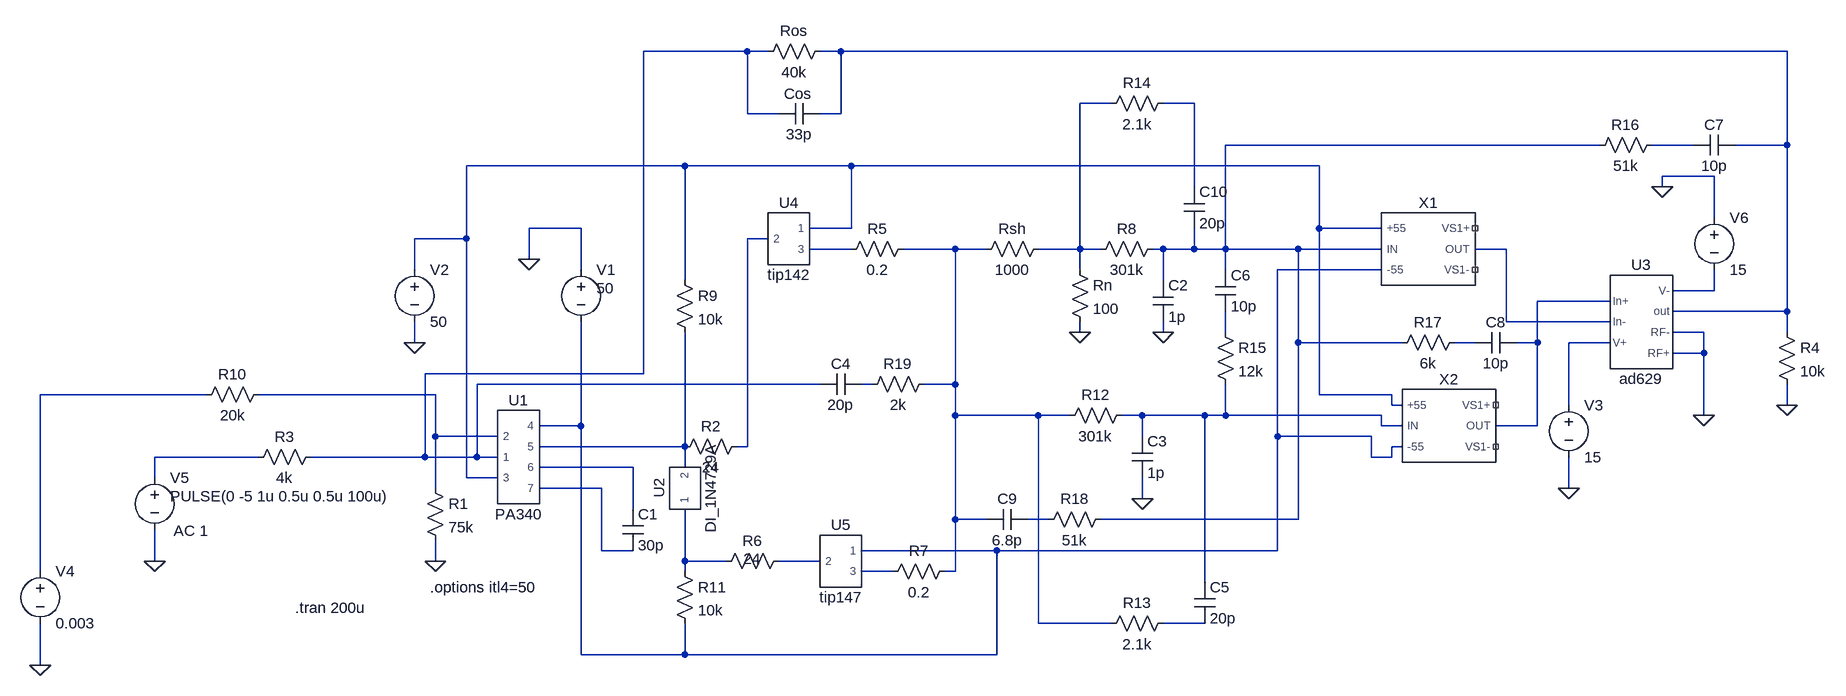
[diagram p0: schematic Draft19.asc]
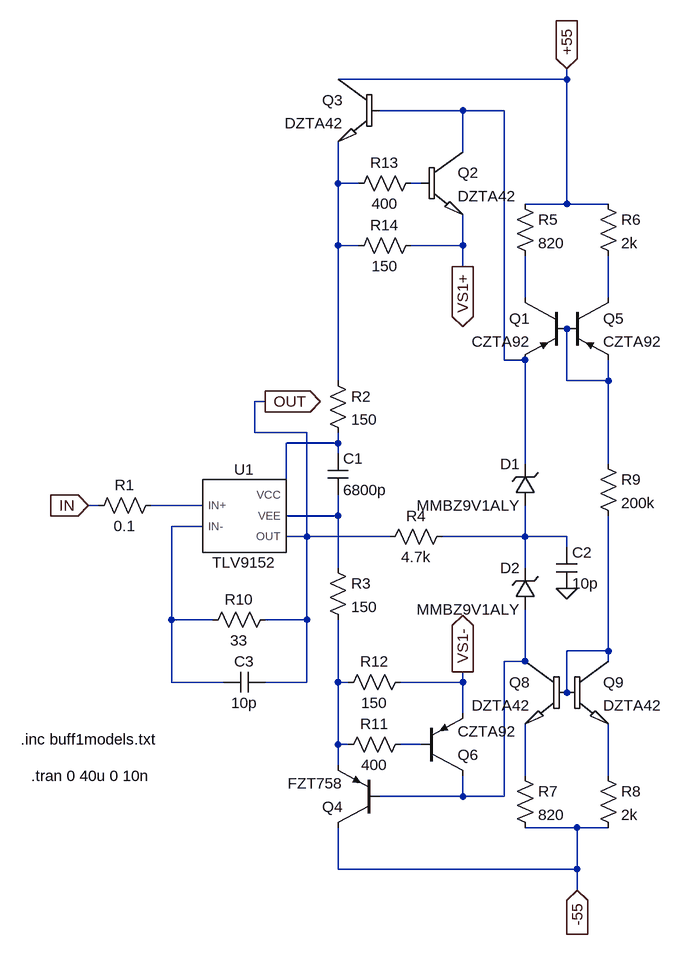
[diagram p1: sub-circuit draft1.asc]
Draft19.asc, the LTspice schematic file:
Version 4
SHEET 1 2340 884
WIRE 544 -464 384 -464
WIRE 576 -464 544 -464
WIRE 688 -464 656 -464
WIRE 2144 -464 688 -464
WIRE 1104 -384 1056 -384
WIRE 1232 -384 1184 -384
WIRE 544 -368 544 -464
WIRE 592 -368 544 -368
WIRE 688 -368 688 -464
WIRE 688 -368 656 -368
WIRE 1856 -320 1280 -320
WIRE 2000 -320 1936 -320
WIRE 2144 -320 2144 -464
WIRE 2144 -320 2064 -320
WIRE 448 -288 112 -288
WIRE 704 -288 448 -288
WIRE 1424 -288 704 -288
WIRE 2032 -272 1952 -272
WIRE 1232 -256 1232 -384
WIRE 1952 -256 1952 -272
WIRE 2032 -208 2032 -272
WIRE 288 -192 208 -192
WIRE 704 -192 704 -288
WIRE 704 -192 640 -192
WIRE 1424 -192 1424 -288
WIRE 1520 -192 1424 -192
WIRE 112 -176 112 -288
WIRE 112 -176 32 -176
WIRE 576 -176 544 -176
WIRE 704 -160 640 -160
WIRE 864 -160 784 -160
WIRE 912 -160 864 -160
WIRE 1056 -160 1056 -384
WIRE 1056 -160 992 -160
WIRE 1088 -160 1056 -160
WIRE 1184 -160 1168 -160
WIRE 1232 -160 1232 -192
WIRE 1232 -160 1184 -160
WIRE 1280 -160 1280 -320
WIRE 1280 -160 1232 -160
WIRE 1392 -160 1280 -160
WIRE 1520 -160 1392 -160
WIRE 1712 -160 1664 -160
WIRE 208 -144 208 -192
WIRE 32 -128 32 -176
WIRE 288 -128 288 -192
WIRE 1056 -128 1056 -160
WIRE 1280 -128 1280 -160
WIRE 1520 -128 1360 -128
WIRE 448 -112 448 -288
WIRE 1184 -112 1184 -160
WIRE 2032 -96 2032 -128
WIRE 2032 -96 1968 -96
WIRE 1872 -80 1760 -80
WIRE 2144 -64 2144 -320
WIRE 2144 -64 1968 -64
WIRE 1712 -48 1712 -160
WIRE 1872 -48 1712 -48
WIRE 1056 -32 1056 -48
WIRE 1184 -32 1184 -48
WIRE 1280 -32 1280 -64
WIRE 2016 -32 1968 -32
WIRE 2144 -32 2144 -64
WIRE 32 -16 32 -48
WIRE 1392 -16 1392 -160
WIRE 1552 -16 1392 -16
WIRE 1664 -16 1632 -16
WIRE 1760 -16 1760 -80
WIRE 1760 -16 1728 -16
WIRE 1872 -16 1808 -16
WIRE 2016 0 2016 -32
WIRE 2016 0 1968 0
WIRE 384 32 384 -464
WIRE 384 32 48 32
WIRE 656 48 128 48
WIRE 736 48 720 48
WIRE 864 48 864 -160
WIRE 864 48 816 48
WIRE -288 64 -544 64
WIRE 64 64 -208 64
WIRE 1424 64 1424 -192
WIRE 1536 64 1424 64
WIRE 1536 80 1536 64
WIRE 1552 80 1536 80
WIRE 1808 80 1808 -16
WIRE 2144 80 2144 48
WIRE 864 96 864 48
WIRE 992 96 864 96
WIRE 1040 96 992 96
WIRE 1152 96 1120 96
WIRE 1248 96 1152 96
WIRE 1280 96 1280 48
WIRE 1280 96 1248 96
WIRE 1520 96 1280 96
WIRE 2016 96 2016 0
WIRE 288 112 288 -48
WIRE 288 112 224 112
WIRE 1520 112 1520 96
WIRE 1552 112 1520 112
WIRE 1760 112 1760 -16
WIRE 1760 112 1696 112
WIRE 64 128 64 64
WIRE 160 128 64 128
WIRE 1152 128 1152 96
WIRE 1360 128 1360 -128
WIRE 1504 128 1360 128
WIRE 448 144 448 -32
WIRE 448 144 224 144
WIRE 544 144 544 -176
WIRE 544 144 528 144
WIRE 1552 144 1536 144
WIRE -208 160 -368 160
WIRE 48 160 48 32
WIRE 48 160 -128 160
WIRE 128 160 128 48
WIRE 128 160 48 160
WIRE 160 160 128 160
WIRE 1504 160 1504 128
WIRE 1536 160 1536 144
WIRE 1536 160 1504 160
WIRE 368 176 224 176
WIRE 448 176 448 144
WIRE -368 192 -368 160
WIRE 112 192 112 -176
WIRE 160 192 112 192
WIRE 64 208 64 128
WIRE 320 208 224 208
WIRE 1808 208 1808 160
WIRE 1152 224 1152 192
WIRE 368 240 368 176
WIRE 864 256 864 96
WIRE 912 256 864 256
WIRE 1008 256 976 256
WIRE 1392 256 1392 -16
WIRE 1392 256 1088 256
WIRE 320 304 320 208
WIRE 368 304 320 304
WIRE 928 304 720 304
WIRE 1360 304 1360 128
WIRE 1360 304 928 304
WIRE -368 320 -368 272
WIRE 64 320 64 288
WIRE 448 320 448 240
WIRE 512 320 448 320
WIRE 656 320 592 320
WIRE -544 336 -544 64
WIRE 448 336 448 320
WIRE 768 336 720 336
WIRE 864 336 864 256
WIRE 864 336 848 336
WIRE 1248 352 1248 96
WIRE 992 416 992 96
WIRE 1104 416 992 416
WIRE 1248 416 1184 416
WIRE 288 464 288 112
WIRE 448 464 448 416
WIRE 448 464 288 464
WIRE 928 464 928 304
WIRE 928 464 448 464
WIRE -544 480 -544 416
FLAG 32 -16 0
FLAG 208 -144 0
FLAG -544 480 0
FLAG 1056 -32 0
FLAG -368 320 0
FLAG 64 320 0
FLAG 1808 208 0
FLAG 2016 96 0
FLAG 1952 -256 0
FLAG 2144 80 0
FLAG 1184 -32 0
FLAG 1152 224 0
SYMBOL PA340 192 160 R0
SYMATTR InstName U1
SYMBOL res 48 192 R0
SYMATTR InstName R1
SYMATTR Value 75k
SYMBOL res 544 128 R90
WINDOW 0 0 56 VBottom 2
WINDOW 3 32 56 VTop 2
SYMATTR InstName R2
SYMATTR Value 24
SYMBOL res -112 144 R90
WINDOW 0 0 56 VBottom 2
WINDOW 3 32 56 VTop 2
SYMATTR InstName R3
SYMATTR Value 4k
SYMBOL cap 352 240 R0
SYMATTR InstName C1
SYMATTR Value 30p
SYMBOL voltage 288 -144 R0
WINDOW 3 24 44 Left 2
WINDOW 123 0 0 Left 0
WINDOW 39 0 0 Left 0
SYMATTR Value 50
SYMATTR InstName V1
SYMBOL voltage 32 -144 R0
WINDOW 123 0 0 Left 0
WINDOW 39 0 0 Left 0
SYMATTR InstName V2
SYMATTR Value 50
SYMBOL res 1040 -144 R0
SYMATTR InstName Rn
SYMATTR Value 100
SYMBOL res 672 -480 R90
WINDOW 0 0 56 VBottom 2
WINDOW 3 32 56 VTop 2
SYMATTR InstName Ros
SYMATTR Value 40k
SYMBOL cap 656 -384 R90
WINDOW 0 1 34 VBottom 2
WINDOW 3 32 32 VTop 2
SYMATTR InstName Cos
SYMATTR Value 33p
SYMBOL res -192 48 R90
WINDOW 0 0 56 VBottom 2
WINDOW 3 32 56 VTop 2
SYMATTR InstName R10
SYMATTR Value 20k
SYMBOL voltage -368 176 R0
WINDOW 123 29 97 Left 2
WINDOW 39 0 0 Left 0
WINDOW 3 24 44 Left 2
SYMATTR Value2 AC 1
SYMATTR Value PULSE(0 -5 1u 0.5u 0.5u 100u)
SYMATTR InstName V5
SYMBOL res 608 304 R90
WINDOW 0 0 56 VBottom 2
WINDOW 3 28 56 VBottom 2
SYMATTR InstName R6
SYMATTR Value 24
SYMBOL voltage -544 320 R0
WINDOW 123 0 0 Left 0
WINDOW 39 0 0 Left 0
SYMATTR InstName V4
SYMATTR Value 0.003
SYMBOL tip142 608 -176 R0
SYMATTR InstName U4
SYMBOL tip147 688 320 R0
SYMATTR InstName U5
SYMBOL res 800 -176 R90
WINDOW 0 0 56 VBottom 2
WINDOW 3 32 56 VTop 2
SYMATTR InstName R5
SYMATTR Value 0.2
SYMBOL res 864 320 R90
WINDOW 0 0 56 VBottom 2
WINDOW 3 32 56 VTop 2
SYMATTR InstName R7
SYMATTR Value 0.2
SYMBOL res 432 -128 R0
SYMATTR InstName R9
SYMATTR Value 10k
SYMBOL res 432 320 R0
SYMATTR InstName R11
SYMATTR Value 10k
SYMBOL DI_1N4729A 448 208 R270
SYMATTR InstName U2
SYMBOL res 1008 -176 R90
WINDOW 0 0 56 VBottom 2
WINDOW 3 32 56 VTop 2
SYMATTR InstName Rsh
SYMATTR Value 1000
SYMBOL ad629 1920 -48 R0
SYMATTR InstName U3
SYMBOL voltage 1808 64 R0
WINDOW 123 0 0 Left 0
WINDOW 39 0 0 Left 0
SYMATTR InstName V3
SYMATTR Value 15
SYMBOL voltage 2032 -224 R0
WINDOW 123 0 0 Left 0
WINDOW 39 0 0 Left 0
SYMATTR InstName V6
SYMATTR Value 15
SYMBOL res 2128 -48 R0
SYMATTR InstName R4
SYMATTR Value 10k
SYMBOL res 1184 -176 R90
WINDOW 0 0 56 VBottom 2
WINDOW 3 32 56 VTop 2
SYMATTR InstName R8
SYMATTR Value 301k
SYMBOL res 1136 80 R90
WINDOW 0 0 56 VBottom 2
WINDOW 3 32 56 VTop 2
SYMATTR InstName R12
SYMATTR Value 301k
SYMBOL cap 1168 -112 R0
SYMATTR InstName C2
SYMATTR Value 1p
SYMBOL cap 1136 128 R0
SYMATTR InstName C3
SYMATTR Value 1p
SYMBOL cap 1264 -128 R0
SYMATTR InstName C6
SYMATTR Value 10p
SYMBOL res 1264 -48 R0
SYMATTR InstName R15
SYMATTR Value 12k
SYMBOL cap 2064 -336 R90
WINDOW 0 0 32 VBottom 2
WINDOW 3 32 32 VTop 2
SYMATTR InstName C7
SYMATTR Value 10p
SYMBOL res 1952 -336 R90
WINDOW 0 0 56 VBottom 2
WINDOW 3 32 56 VTop 2
SYMATTR InstName R16
SYMATTR Value 51k
SYMBOL cap 1728 -32 R90
WINDOW 0 0 32 VBottom 2
WINDOW 3 32 32 VTop 2
SYMATTR InstName C8
SYMATTR Value 10p
SYMBOL res 1648 -32 R90
WINDOW 0 0 56 VBottom 2
WINDOW 3 32 56 VTop 2
SYMATTR InstName R17
SYMATTR Value 6k
SYMBOL cap 976 240 R90
WINDOW 0 0 32 VBottom 2
WINDOW 3 32 32 VTop 2
SYMATTR InstName C9
SYMATTR Value 6.8p
SYMBOL res 1104 240 R90
WINDOW 0 0 56 VBottom 2
WINDOW 3 32 56 VTop 2
SYMATTR InstName R18
SYMATTR Value 51k
SYMBOL Draft1 1584 -160 R0
SYMATTR InstName X1
SYMBOL Draft1 1616 112 R0
SYMATTR InstName X2
SYMBOL cap 1232 352 R0
SYMATTR InstName C5
SYMATTR Value 20p
SYMBOL res 1200 400 R90
WINDOW 0 0 56 VBottom 2
WINDOW 3 32 56 VTop 2
SYMATTR InstName R13
SYMATTR Value 2.1k
SYMBOL cap 1216 -256 R0
SYMATTR InstName C10
SYMATTR Value 20p
SYMBOL res 1200 -400 R90
WINDOW 0 0 56 VBottom 2
WINDOW 3 32 56 VTop 2
SYMATTR InstName R14
SYMATTR Value 2.1k
SYMBOL cap 720 32 R90
WINDOW 0 0 32 VBottom 2
WINDOW 3 32 32 VTop 2
SYMATTR InstName C4
SYMATTR Value 20p
SYMBOL res 832 32 R90
WINDOW 0 0 56 VBottom 2
WINDOW 3 32 56 VTop 2
SYMATTR InstName R19
SYMATTR Value 2k
TEXT 56 360 Left 2 !.options itl4=50
TEXT -152 392 Left 2 !.tran 200u

draft1.asc, the sub-circuit schematic file:
Version 4
SHEET 1 1440 892
WIRE 688 -496 688 -512
WIRE 688 -496 336 -496
WIRE 528 -448 400 -448
WIRE 592 -448 528 -448
WIRE 528 -384 528 -448
WIRE 336 -336 336 -400
WIRE 368 -336 336 -336
WIRE 464 -336 448 -336
WIRE 688 -304 688 -496
WIRE 688 -304 624 -304
WIRE 752 -304 688 -304
WIRE 336 -240 336 -336
WIRE 368 -240 336 -240
WIRE 528 -240 528 -288
WIRE 528 -240 448 -240
WIRE 528 -208 528 -240
WIRE 624 -160 624 -224
WIRE 752 -160 752 -224
WIRE 592 -64 592 -448
WIRE 624 -64 592 -64
WIRE 336 -32 336 -240
WIRE 688 -32 688 -112
WIRE 752 -32 752 -64
WIRE 752 -32 688 -32
WIRE 224 0 208 0
WIRE 208 48 208 0
WIRE 288 48 208 48
WIRE 336 64 336 48
WIRE 336 64 256 64
WIRE 336 80 336 64
WIRE 624 96 624 -64
WIRE 752 96 752 -32
WIRE 256 144 256 64
WIRE -32 160 -48 160
WIRE 128 160 48 160
WIRE 336 176 336 144
WIRE 336 176 256 176
WIRE 128 192 80 192
WIRE 288 208 288 48
WIRE 288 208 256 208
WIRE 416 208 288 208
WIRE 624 208 624 160
WIRE 624 208 496 208
WIRE 688 208 624 208
WIRE 688 224 688 208
WIRE 336 256 336 176
WIRE 624 256 624 208
WIRE 80 336 80 192
WIRE 144 336 80 336
WIRE 288 336 288 208
WIRE 288 336 224 336
WIRE 752 384 752 176
WIRE 752 384 688 384
WIRE 624 400 624 320
WIRE 624 400 592 400
WIRE 752 400 752 384
WIRE 80 432 80 336
WIRE 160 432 80 432
WIRE 288 432 288 336
WIRE 288 432 224 432
WIRE 336 432 336 336
WIRE 352 432 336 432
WIRE 528 432 528 416
WIRE 528 432 432 432
WIRE 688 448 688 384
WIRE 528 480 528 432
WIRE 336 528 336 432
WIRE 352 528 336 528
WIRE 464 528 432 528
WIRE 336 560 336 528
WIRE 624 576 624 496
WIRE 752 576 752 496
WIRE 528 608 528 576
WIRE 528 608 400 608
WIRE 592 608 592 400
WIRE 592 608 528 608
WIRE 704 656 624 656
WIRE 752 656 704 656
WIRE 336 720 336 656
WIRE 704 720 704 656
WIRE 704 720 336 720
WIRE 704 752 704 720
FLAG 688 288 0
FLAG -48 160 IN
IOPIN -48 160 In
FLAG 224 0 OUT
IOPIN 224 0 Out
FLAG 688 -512 +55
IOPIN 688 -512 In
FLAG 704 752 -55
IOPIN 704 752 In
FLAG 528 416 VS1-
IOPIN 528 416 Out
FLAG 528 -208 VS1+
IOPIN 528 -208 Out
SYMBOL TLV9152 192 176 R0
SYMATTR InstName U1
SYMBOL res 320 -48 R0
SYMATTR InstName R2
SYMATTR Value 150
SYMBOL res 320 240 R0
SYMATTR InstName R3
SYMATTR Value 150
SYMBOL res 512 192 R90
WINDOW 0 0 56 VBottom 2
WINDOW 3 32 56 VTop 2
SYMATTR InstName R4
SYMATTR Value 4.7k
SYMBOL res 608 -320 R0
SYMATTR InstName R5
SYMATTR Value 820
SYMBOL res 736 -320 R0
SYMATTR InstName R6
SYMATTR Value 2k
SYMBOL res 608 560 R0
SYMATTR InstName R7
SYMATTR Value 820
SYMBOL res 736 560 R0
SYMATTR InstName R8
SYMATTR Value 2k
SYMBOL res 736 80 R0
SYMATTR InstName R9
SYMATTR Value 200k
SYMBOL res 240 320 R90
WINDOW 0 0 56 VBottom 2
WINDOW 3 32 56 VTop 2
SYMATTR InstName R10
SYMATTR Value 33
SYMBOL cap 320 80 R0
SYMATTR InstName C1
SYMATTR Value 6800p
SYMBOL zener 640 160 R180
WINDOW 0 24 64 Left 2
WINDOW 3 24 0 Left 2
SYMATTR InstName D1
SYMATTR Value MMBZ9V1ALY
SYMBOL zener 640 320 R180
WINDOW 0 24 64 Left 2
WINDOW 3 24 0 Left 2
SYMATTR InstName D2
SYMATTR Value MMBZ9V1ALY
SYMBOL cap 672 224 R0
SYMATTR InstName C2
SYMATTR Value 10p
SYMBOL pnp 688 -160 M0
SYMATTR InstName Q1
SYMATTR Value CZTA92
SYMBOL pnp 688 -160 R0
SYMATTR InstName Q5
SYMATTR Value CZTA92
SYMBOL pnp 400 656 R180
SYMATTR InstName Q4
SYMATTR Value FZT758
SYMBOL res 64 144 R90
WINDOW 0 0 56 VBottom 2
WINDOW 3 32 56 VTop 2
SYMATTR InstName R1
SYMATTR Value 0.1
SYMBOL pnp 464 576 M180
SYMATTR InstName Q6
SYMATTR Value CZTA92
SYMBOL res 448 512 R90
WINDOW 0 0 56 VBottom 2
WINDOW 3 32 56 VTop 2
SYMATTR InstName R11
SYMATTR Value 400
SYMBOL res 448 416 R90
WINDOW 0 0 56 VBottom 2
WINDOW 3 32 56 VTop 2
SYMATTR InstName R12
SYMATTR Value 150
SYMBOL res 464 -352 R90
WINDOW 0 0 56 VBottom 2
WINDOW 3 32 56 VTop 2
SYMATTR InstName R13
SYMATTR Value 400
SYMBOL res 464 -256 R90
WINDOW 0 0 56 VBottom 2
WINDOW 3 32 56 VTop 2
SYMATTR InstName R14
SYMATTR Value 150
SYMBOL DZTA42 464 -384 R0
SYMATTR InstName Q2
SYMBOL DZTA42 400 -496 M0
SYMATTR InstName Q3
SYMBOL DZTA42 688 400 M0
SYMATTR InstName Q8
SYMBOL DZTA42 688 400 R0
SYMATTR InstName Q9
SYMBOL cap 224 416 R90
WINDOW 0 0 32 VBottom 2
WINDOW 3 32 32 VTop 2
SYMATTR InstName C3
SYMATTR Value 10p
TEXT -152 520 Left 2 !.inc buff1models.txt
TEXT -136 576 Left 2 !.tran 0 40u 0 10n

The netlist it stands for:
* Draft19.asc
XU1 N020 N001 N007 N012 N022 N024 N025 PA340  ; pins 2 1 3 4 5 6 7
R1 N020 0 75k
R2 N008 N022 24
R3 N001 N023 4k
C1 N024 N025 30p
V1 0 N012 50
V2 N007 0 50
Rn N003 0 100
Ros N002 N001 40k
Cos N002 N001 33p
R10 N020 N019 20k
V5 N023 0 PULSE(0 -5 1u 0.5u 0.5u 100u) AC 1
R6 N028 N027 24
V4 N019 0 0.003
XU4 N007 N008 N009 tip142  ; pins 1 2 3
XU5 N012 N028 N029 tip147  ; pins 1 2 3
R5 N010 N009 0.2
R7 N010 N029 0.2
R9 N007 N022 10k
R11 N027 N012 10k
XU2 N027 N022 DI_1N4729A  ; pins 1 2
Rsh N003 N010 1000
XU3 N014 N011 N017 N013 N002 0 0 ad629  ; pins In+ In- V+ V- out RF- RF+
V3 N017 0 15
V6 0 N013 15
R4 N002 0 10k
R8 N005 N003 301k
R12 N021 N010 301k
C2 N005 0 1p
C3 N021 0 1p
C6 N005 N015 10p
R15 N015 N021 12k
C7 N002 N006 10p
R16 N006 N005 51k
C8 N014 N016 10p
R17 N016 N005 6k
C9 N026 N010 6.8p
R18 N005 N026 51k
XX1 N007 N012 N005 N011 NC_01 NC_02 draft1
XX2 N007 N012 N021 N014 NC_03 NC_04 draft1
C5 N021 N030 20p
R13 N030 N010 2.1k
C10 N004 N005 20p
R14 N004 N003 2.1k
C4 N018 N001 20p
R19 N010 N018 2k

* block symbol definitions
.subckt draft1 +55 -55 IN OUT VS1+ VS1-
XU1 N008 N010 N007 N009 OUT TLV9152  ; pins IN+ IN- VCC VEE OUT
R2 N002 N007 150
R3 N009 N014 150
R4 N011 OUT 4.7k
R5 +55 N004 820
R6 +55 N005 2k
R7 N016 -55 820
R8 N017 -55 2k
R9 N006 N012 200k
R10 OUT N010 33
C1 N007 N009 6800p
D1 N011 N001 MMBZ9V1ALY
D2 N013 N011 MMBZ9V1ALY
C2 N011 0 10p
Q1 N004 N006 N001 0 CZTA92
Q5 N005 N006 N006 0 CZTA92
Q4 -55 N013 N014 0 FZT758
R1 N008 IN 0.1
Q6 N013 N015 VS1- 0 CZTA92
R11 N015 N014 400
R12 VS1- N014 150
R13 N003 N002 400
R14 VS1+ N002 150
Q2 N001 N003 VS1+ 0 DZTA42
Q3 +55 N001 N002 0 DZTA42
Q8 N013 N012 N016 0 DZTA42
Q9 N012 N012 N017 0 DZTA42
C3 OUT N010 10p
.inc buff1models.txt
.tran 0 40u 0 10n
.ends draft1

.model D D
.lib standard.dio
.model NPN NPN
.model PNP PNP
.lib standard.bjt
.options itl4=50
.tran 200u
.lib PA340_Pspice.LIB
.lib TIP142.cir
.lib TIP147.cir
.lib 1N4729A.cir
.lib ad629.cir
.lib .\tlv9152.lib
.lib DZTA42
.backanno
.end